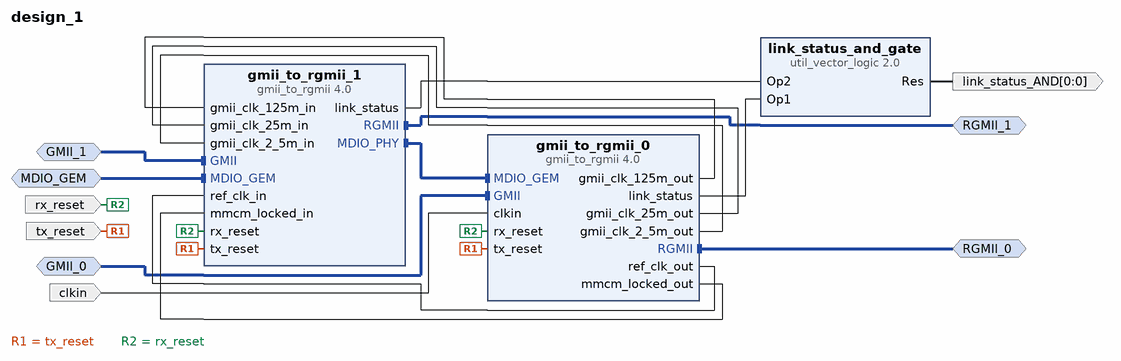
[diagram p0: block diagram of the top level]
# Vivado block design design_1, Vivado 2016.2
create_bd_design design_1

create_bd_intf_port -mode Master -vlnv xilinx.com:interface:rgmii_rtl:1.0 RGMII_0
create_bd_intf_port -mode Master -vlnv xilinx.com:interface:rgmii_rtl:1.0 RGMII_1
create_bd_intf_port -mode Slave -vlnv xilinx.com:interface:gmii_rtl:1.0 GMII_1
create_bd_intf_port -mode Slave -vlnv xilinx.com:interface:gmii_rtl:1.0 GMII_0
create_bd_intf_port -mode Slave -vlnv xilinx.com:interface:mdio_rtl:1.0 MDIO_GEM
create_bd_port -dir I -type rst tx_reset
set_property -dict {CONFIG.POLARITY ACTIVE_HIGH} [get_bd_ports tx_reset]
create_bd_port -dir I -type rst rx_reset
set_property -dict {CONFIG.POLARITY ACTIVE_HIGH} [get_bd_ports rx_reset]
create_bd_port -dir O -from 0 -to 0 link_status_AND
create_bd_port -dir I -type clk clkin

create_bd_cell -type ip -vlnv xilinx.com:ip:gmii_to_rgmii:4.0 gmii_to_rgmii_0
set_property -dict {CONFIG.C_PHYADDR 7 CONFIG.SupportLevel Include_Shared_Logic_in_Core} [get_bd_cells gmii_to_rgmii_0]
create_bd_cell -type ip -vlnv xilinx.com:ip:gmii_to_rgmii:4.0 gmii_to_rgmii_1
create_bd_cell -type ip -vlnv xilinx.com:ip:util_vector_logic:2.0 link_status_and_gate
set_property -dict {CONFIG.C_SIZE 1} [get_bd_cells link_status_and_gate]

# ---- connections ----

connect_bd_intf_net [get_bd_intf_pins gmii_to_rgmii_1/MDIO_PHY] [get_bd_intf_pins gmii_to_rgmii_0/MDIO_GEM]
connect_bd_intf_net [get_bd_intf_ports RGMII_0] [get_bd_intf_pins gmii_to_rgmii_0/RGMII]
connect_bd_intf_net [get_bd_intf_ports RGMII_1] [get_bd_intf_pins gmii_to_rgmii_1/RGMII]
connect_bd_intf_net [get_bd_intf_ports GMII_1] [get_bd_intf_pins gmii_to_rgmii_1/GMII]
connect_bd_intf_net -intf_net GMII_1_1 [get_bd_intf_ports GMII_0] [get_bd_intf_pins gmii_to_rgmii_0/GMII]
connect_bd_intf_net [get_bd_intf_ports MDIO_GEM] [get_bd_intf_pins gmii_to_rgmii_1/MDIO_GEM]
connect_bd_net [get_bd_pins gmii_to_rgmii_0/gmii_clk_125m_out] [get_bd_pins gmii_to_rgmii_1/gmii_clk_125m_in]
connect_bd_net [get_bd_pins gmii_to_rgmii_0/gmii_clk_25m_out] [get_bd_pins gmii_to_rgmii_1/gmii_clk_25m_in]
connect_bd_net [get_bd_pins gmii_to_rgmii_0/gmii_clk_2_5m_out] [get_bd_pins gmii_to_rgmii_1/gmii_clk_2_5m_in]
connect_bd_net [get_bd_pins gmii_to_rgmii_0/ref_clk_out] [get_bd_pins gmii_to_rgmii_1/ref_clk_in]
connect_bd_net [get_bd_pins gmii_to_rgmii_0/mmcm_locked_out] [get_bd_pins gmii_to_rgmii_1/mmcm_locked_in]
connect_bd_net [get_bd_ports tx_reset] [get_bd_pins gmii_to_rgmii_0/tx_reset] [get_bd_pins gmii_to_rgmii_1/tx_reset]
connect_bd_net [get_bd_ports rx_reset] [get_bd_pins gmii_to_rgmii_0/rx_reset] [get_bd_pins gmii_to_rgmii_1/rx_reset]
connect_bd_net [get_bd_pins gmii_to_rgmii_0/link_status] [get_bd_pins link_status_and_gate/Op1]
connect_bd_net [get_bd_pins gmii_to_rgmii_1/link_status] [get_bd_pins link_status_and_gate/Op2]
connect_bd_net -net util_vector_logic_0_Res [get_bd_pins link_status_and_gate/Res] [get_bd_ports link_status_AND]
connect_bd_net [get_bd_ports clkin] [get_bd_pins gmii_to_rgmii_0/clkin]

validate_bd_design
save_bd_design
